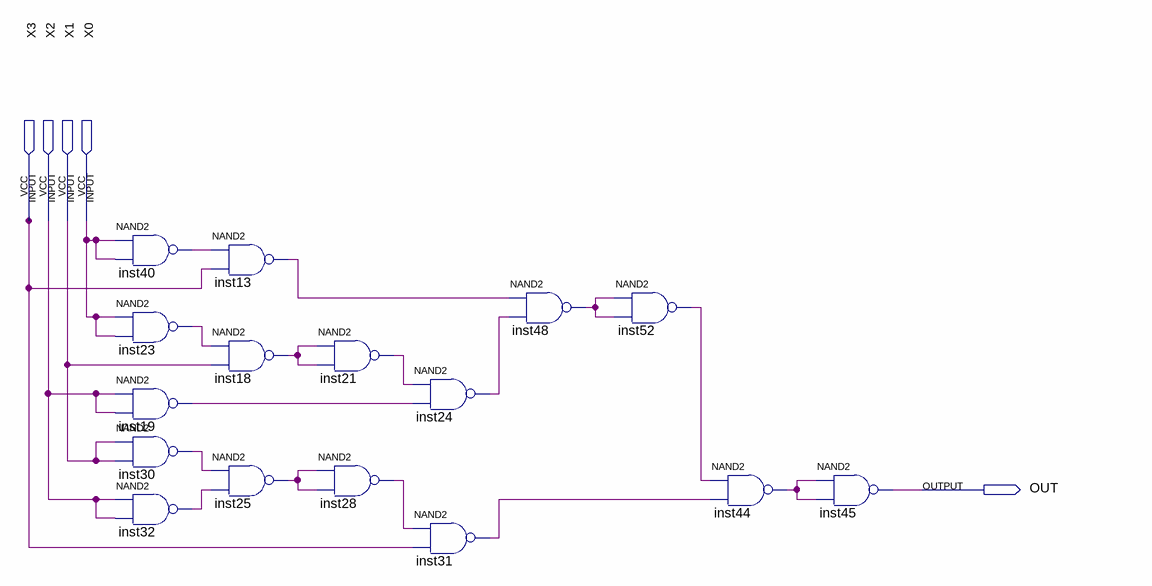
[diagram p0: schematic sheet]
// Quartus schematic E.bdf as structural Verilog: 16 symbols, 5 pins
module E (
  input  X3,
  input  X2,
  input  X1,
  input  X0,
  output OUT
);

  wire inst13_out, inst18_out, inst19_out, inst21_out, inst23_out, inst24_out, inst25_out, inst28_out,
       inst30_out, inst31_out, inst32_out, inst40_out, inst44_out, inst48_out, inst52_out;

  nand inst40 (inst40_out, X0, X0);
  nand inst23 (inst23_out, X0, X0);
  nand inst19 (inst19_out, X2, X2);
  nand inst30 (inst30_out, X1, X1);
  nand inst32 (inst32_out, X2, X2);
  nand inst13 (inst13_out, inst40_out, X3);
  nand inst18 (inst18_out, inst23_out, X1);
  nand inst25 (inst25_out, inst30_out, inst32_out);
  nand inst21 (inst21_out, inst18_out, inst18_out);
  nand inst28 (inst28_out, inst25_out, inst25_out);
  nand inst24 (inst24_out, inst21_out, inst19_out);
  nand inst31 (inst31_out, inst28_out, X3);
  nand inst48 (inst48_out, inst13_out, inst24_out);
  nand inst52 (inst52_out, inst48_out, inst48_out);
  nand inst44 (inst44_out, inst52_out, inst31_out);
  nand inst45 (OUT, inst44_out, inst44_out);
endmodule
